# Altium project Control_Board_Model_C201.PrjPcb (part 5 of 8)

## Sheet User_Interface.SchDoc: User Interface
size A4; DocumentNumber: 13; SheetNumber: 13; SheetTotal: 50
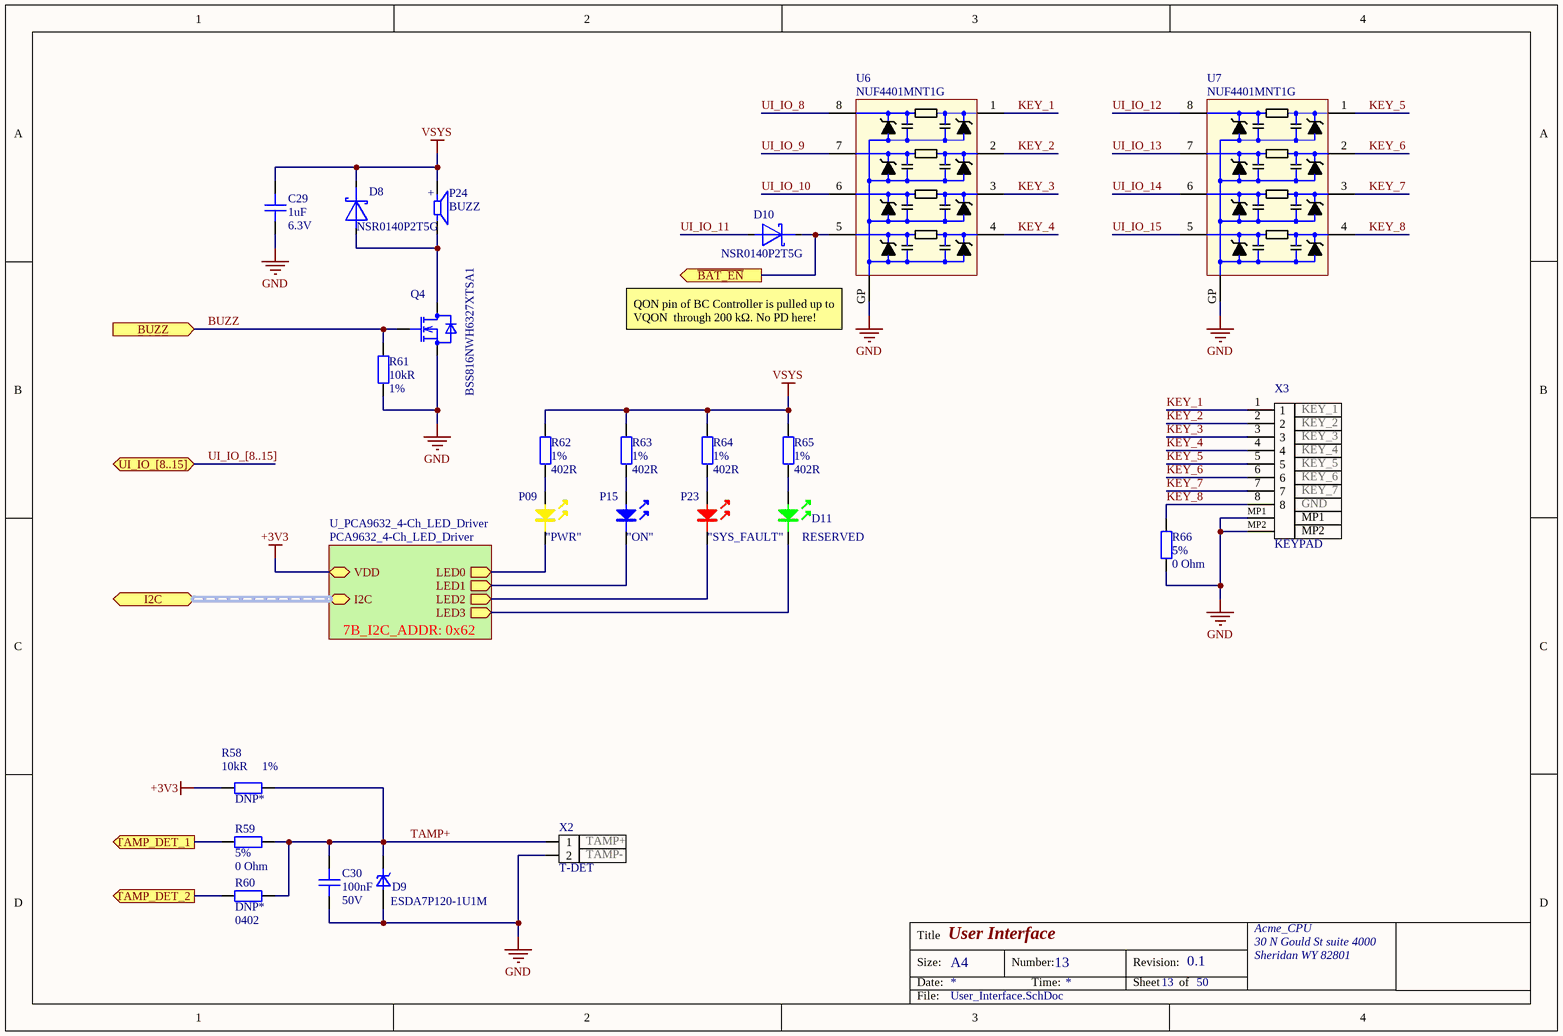
[diagram p10: User_Interface.SchDoc]

### Parts
C29  Capacitance: 1uF  Voltage Rating: 6.3V  [C0402]  (hidden comment: CAP CER 1UF 6.3V X5R 0402)
C30  Capacitance: 100nF  Voltage: 50V  [C0402]  (hidden comment: CAP CER 0.1UF 50V X7R 0402)
D8  NSR0140P2T5G  [SODFL100X40-2N]
D9  ESDA7P120-1U1M  [ST_QFN_1610]
D10  NSR0140P2T5G  [SODFL100X40-2N]
D11  RESERVED  [LED_0603]
P09  "PWR"  [LED_0603]
P15  "ON"  [LED_0603]
P23  "SYS_FAULT"  [LED_0603]
P24  BUZZ  [SMT-0440-S-R_PUI]
Q4  BSS816NWH6327XTSA1  [SOT-323]
R58  DNP*  Resistance: 10kR  Tolerance: 1%  [R0402]  (no BOM)
R59  Tolerance: 5%  Resistance: 0 Ohm  [R0402]  (hidden comment: RES SMD 0 OHM JUMPER 1/16W 0402)
R60  DNP*  Case/Package: 0402  [R0402]  (no BOM)
R61  Resistance: 10kR  Tolerance: 1%  [R0402]  (hidden comment: RES SMD 10K OHM 1% 1/16W 0402)
R62  Tolerance: 1%  Resistance: 402R  [R0402]  (hidden comment: RES SMD 402 OHM 1% 1/16W 0402)
R63  Tolerance: 1%  Resistance: 402R  [R0402]  (hidden comment: RES SMD 402 OHM 1% 1/16W 0402)
R64  Tolerance: 1%  Resistance: 402R  [R0402]  (hidden comment: RES SMD 402 OHM 1% 1/16W 0402)
R65  Tolerance: 1%  Resistance: 402R  [R0402]  (hidden comment: RES SMD 402 OHM 1% 1/16W 0402)
R66  Tolerance: 5%  Resistance: 0 Ohm  [R0402]  (hidden comment: RES SMD 0 OHM JUMPER 1/16W 0402)
U6  NUF4401MNT1G  [DFN8]
U7  NUF4401MNT1G  [DFN8]
X2  T-DET  pin_1: TAMP+  pin_2: TAMP-  [CONN_S2B-ZR_JST]
X3  KEYPAD  pin_7: KEY_7  pin_1: KEY_1  pin_2: KEY_2  pin_3: KEY_3  pin_4: KEY_4  pin_5: KEY_5  pin_6: KEY_6  pin_8: GND  pin_MP1: MP1  pin_MP2: MP2  [686108183522]

### Sub-sheets
U_PCA9632_4-Ch_LED_Driver = PCA9632_4-Ch_LED_Driver (file not in this document): VDD, LED0 (out), LED1 (out), LED2 (out), LED3 (out), I2C (harness I2C)  | 7B_I2C_ADDR: 0x62

### Ports
BUZZ (in), I2C (harness I2C), TAMP_DET_1 (out), TAMP_DET_2 (out), UI_IO_[8..15] (bidir), ~{BAT_EN} (out)

### Nets
+3V3: R58.1 ; sheet U_PCA9632_4-Ch_LED_Driver/VDD
GND: C29.2 C30.2 D9.2(A) Q4.2(S) R61.2 R66.1 U6.GP(GND) U7.GP(GND) X2.2 X3.MP1 X3.MP2
VSYS: C29.1 D8.1(K) P24.1 R62.2 R63.2 R64.2 R65.2
~{UI_BAT_EN}: D10.1(K) U6.5(OUT4) ; port ~{BAT_EN}
BUZZ: Q4.1(G) R61.1 ; port BUZZ
KEY_1: U6.1(INP1) X3.1
KEY_2: U6.2(INP2) X3.2
KEY_3: U6.3(INP3) X3.3
KEY_4: U6.4(INP4) X3.4
KEY_5: U7.1(INP1) X3.5
KEY_6: U7.2(INP2) X3.6
KEY_7: U7.3(INP3) X3.7
KEY_8: R66.2 U7.4(INP4) X3.8
PC13: R59.1 ; port TAMP_DET_1
TAMP+: C30.1 D9.1(K) R58.2 R59.2 R60.1 X2.1
TAMP_RTC: R60.2 ; port TAMP_DET_2
UI_IO_8: U6.8(OUT1)  [project net DIO_3_8]
UI_IO_9: U6.7(OUT2)  [project net DIO_3_9]
UI_IO_10: U6.6(OUT3)  [project net DIO_3_10]
UI_IO_11: D10.2(A)  [project net DIO_3_11]
UI_IO_12: U7.8(OUT1)  [project net DIO_3_12]
UI_IO_13: U7.7(OUT2)  [project net DIO_3_13]
UI_IO_14: U7.6(OUT3)  [project net DIO_3_14]
UI_IO_15: U7.5(OUT4)  [project net DIO_3_15]
NetD8_2: D8.2(A) P24.2 Q4.3(D)
NetD11_1: D11.1(K) ; sheet U_PCA9632_4-Ch_LED_Driver/LED3
NetD11_2: D11.2(A) R65.1
NetP09_1: P09.1(K) ; sheet U_PCA9632_4-Ch_LED_Driver/LED0
NetP09_2: P09.2(A) R62.1
NetP15_1: P15.1(K) ; sheet U_PCA9632_4-Ch_LED_Driver/LED1
NetP15_2: P15.2(A) R63.1
NetP23_1: P23.1(K) ; sheet U_PCA9632_4-Ch_LED_Driver/LED2
NetP23_2: P23.2(A) R64.1

### Buses and harness runs
bus UI_IO_[8..15] = port UI_IO_[8..15]
harness port I2C = sheet U_PCA9632_4-Ch_LED_Driver/I2C

### Notes on the sheet
- (near U6) QON pin of BC Controller is pulled up to VQON  through 200 kΩ. No PD here!
- Title
- Size:
- Date:
- A4
- Number:
- Time:
- Revision:
- Sheet
- of
- File:
- (in symbol AUDIO MAGNETIC XDCR 2-4V SMD) +

### Library data of the parts
C29 = CAP CER 1UF 6.3V X5R 0402: 1µF ±10% 6.3V Ceramic Capacitor X5R 0402 (1005 Metric); Manufacturer: Yageo; Manufacturer Part Number: CC0402KRX5R5BB105; Supplier 1: Digi-Key; Stock 1: 34926286; Pricing 1: 1=0.1, 10=0.05, 50=0.0272, 100=0.0222, 500=0.0158, 1000=0.0124, 2500=0.0113, 5000=0.0104 (USD); Mount: Surface Mount; Case/Package: 0402; Number of Pins: 2; Case Code (Metric): 1005; Case Code (Imperial): 0402; Min Operating Temperature: -55°C; Max Operating Temperature: 85°C; Packaging: Tape and Reel; Tolerance: 10%; Voltage Rating (DC): 6.3V; Dielectric: X5R; Termination: SMD/SMT; Package Quantity: 1; Composition: Ceramic; Length: 1mm; Height: 0.5mm; Width: 0.02inch; Thickness: 0.022inch; Depth: 0.5mm; Radiation Hardening: No; REACH SVHC: No SVHC; ComponentLink1URL: http://www.farnell.com/datasheets/70765.pdf?src-supplier=Farnell; ComponentLink1Description: http://www.farnell.com/datasheets/70765.pdf?src-supplier=Farnell; ComponentLink2URL: http://www.yageo.com/documents/recent/UPY-GPHC_X5R_4V-to-50V_25.pdf?src-supplier=Digi-Key; ComponentLink2Description: http://www.yageo.com/documents/recent/UPY-GPHC_X5R_4V-to-50V_25.pdf?src-supplier=Digi-Key; ComponentLink3URL: http://www.farnell.com/datasheets/2167237.pdf?src-supplier=Element14; ComponentLink3Description: http://www.farnell.com/datasheets/2167237.pdf?src-supplier=Element14; ComponentLink4URL: http://www.yageo.com/documents/recent/UPY-GPHC_X5R_4V-to-50V_12.pdf?src-supplier=Avnet+Europe; ComponentLink4Description: http://www.yageo.com/documents/recent/UPY-GPHC_X5R_4V-to-50V_12.pdf?src-supplier=Avnet+Europe; ComponentLink5URL: http://www.farnell.com/datasheets/1359354.pdf?src-supplier=Element14; ComponentLink5Description: http://www.farnell.com/datasheets/1359354.pdf?src-supplier=Element14; Supplier Part Number 1: 311-1438-1-ND; Dielectric Material: Ceramic; Lead Free: Lead Free; Halogen Free: Halogen Free; ComponentLink6URL: http://www.farnell.com/datasheets/70765.pdf?src-supplier=Element14; ComponentLink6Description: http://www.farnell.com/datasheets/70765.pdf?src-supplier=Element14; ComponentLink7URL: http://www.yageo.com/documents/recent/UPY-GPHC_X5R_4V-to-50V_12.pdf?src-supplier=Avnet; ComponentLink7Description: http://www.yageo.com/documents/recent/UPY-GPHC_X5R_4V-to-50V_12.pdf?src-supplier=Avnet
C30 = CAP CER 0.1UF 50V X7R 0402: 0.1µF ±10% 50V Ceramic Capacitor X7R 0402 (1005 Metric); Manufacturer: TDK; Manufacturer Part Number: CGA2B3X7R1H104K050BB; Supplier 1: Digi-Key; Supplier Part Number 1: 445-6899-1-ND; Stock 1: 2925303; Pricing 1: 1=0.17, 10=0.118, 50=0.0668, 100=0.0553, 500=0.0388, 1000=0.0321, 2500=0.0299, 5000=0.0273 (USD); Mount: Surface Mount; Case/Package: 0402; Weight: 2.3E-05oz; Case Code (Metric): 1005; Case Code (Imperial): 0402; Min Operating Temperature: -55°C; Max Operating Temperature: 125°C; Voltage Rating: 50V; Tolerance: 10%; Packaging: Tape and Reel; Package Quantity: 1; Voltage Rating (DC): 50V; Dielectric: X7R; Termination: SMD/SMT; Composition: Ceramic; Length: 1mm; Height: 0.5mm; Width: 0.02inch; Thickness: 0.022inch; Depth: 0.5mm; Ratings: AEC-Q200; REACH SVHC: No SVHC; Lead Free: Lead Free; ComponentLink1URL: http://product.tdk.com/capacitor/mlcc/en/documents/mlccspec_automotive_general_midvoltage_en.pdf?src-supplier=Future+Electronics; ComponentLink1Description: http://product.tdk.com/capacitor/mlcc/en/documents/mlccspec_automotive_general_midvoltage_en.pdf?src-supplier=Future+Electronics; ComponentLink2URL: http://www.farnell.com/datasheets/1807242.pdf?src-supplier=Element14; ComponentLink2Description: http://www.farnell.com/datasheets/1807242.pdf?src-supplier=Element14; ComponentLink3URL: http://www.mouser.com/ds/2/400/lcc_automotive_general_en-843974.pdf?src-supplier=Mouser; ComponentLink3Description: http://www.mouser.com/ds/2/400/lcc_automotive_general_en-843974.pdf?src-supplier=Mouser; ComponentLink4URL: http://www.farnell.com/datasheets/1936565.pdf?src-supplier=Element14; ComponentLink4Description: http://www.farnell.com/datasheets/1936565.pdf?src-supplier=Element14; ComponentLink5URL: http://www.farnell.com/datasheets/1735392.pdf?src-supplier=Element14; ComponentLink5Description: http://www.farnell.com/datasheets/1735392.pdf?src-supplier=Element14
D8 = DIODE SCHOTTKY 30V 70MA SOD923: Diode Schottky 30V 70mA (DC) Surface Mount SOD-923; Manufacturer: ON Semiconductor; Forward Voltage: 350mV; Max Surge Current: 500mA; Peak Reverse Current: 500nA; Element Configuration: Single; Max Power Dissipation: 100mW; Supplier 1: Digi-Key; Manufacturer Part Number: NSR0140P2T5G; Stock 1: 28802; Pricing 1: 1=0.36, 10=0.27, 25=0.2368, 100=0.1284, 500=0.1048, 1000=0.0777, 2500=0.0683 (USD); Min Operating Temperature: -55°C; Max Operating Temperature: 125°C; Packaging: Tape and Reel; Radiation Hardening: No; Lead Free: Lead Free; ComponentLink1URL: http://www.onsemi.com/pub_link/Collateral/NSR0140P2-D.PDF?src-supplier=Future+Electronics; ComponentLink1Description: http://www.onsemi.com/pub_link/Collateral/NSR0140P2-D.PDF?src-supplier=Future+Electronics; ComponentLink2URL: http://www.farnell.com/datasheets/2353885.pdf?src-supplier=Newark; ComponentLink2Description: http://www.farnell.com/datasheets/2353885.pdf?src-supplier=Newark; ComponentLink3URL: http://www.farnell.com/datasheets/86281.pdf?src-supplier=Element14; ComponentLink3Description: http://www.farnell.com/datasheets/86281.pdf?src-supplier=Element14; Supplier Part Number 1: NSR0140P2T5GOSCT-ND; Number of Pins: 2; Forward Current: 70mA; Package Quantity: 1; Average Rectified Current: 70mA; Max Repetitive Reverse Voltage (Vrrm): 30V; Peak Non-Repetitive Surge Current: 500mA; Max Reverse Voltage (DC): 30V; Max Reverse Leakage Current: 500nA; Case/Package: SOD-923-2; Contact Plating: Tin,Matte; Power Dissipation: 100mW; Max Forward Surge Current (Ifsm): 500mA; Termination: SMD/SMT; Length: 0.85mm; Height: 0.43mm; Width: 0.65mm; REACH SVHC: No SVHC; ComponentLink4URL: http://www.onsemi.com/pub/Collateral/NSR0140P2-D.PDF?src-supplier=Avnet; ComponentLink4Description: http://www.onsemi.com/pub/Collateral/NSR0140P2-D.PDF?src-supplier=Avnet; ComponentLink5URL: http://www.onsemi.com/pub/Collateral/NSR0140P2-D.PDF?src-supplier=Digi-Key; ComponentLink5Description: http://www.onsemi.com/pub/Collateral/NSR0140P2-D.PDF?src-supplier=Digi-Key; ComponentLink6URL: http://www.mouser.com/ds/2/308/NSR0140P2-D-115172.pdf?src-supplier=Mouser; ComponentLink6Description: http://www.mouser.com/ds/2/308/NSR0140P2-D-115172.pdf?src-supplier=Mouser; Mount: Surface Mount
D9 = TVS DIODE ESDA7P120-1U1M 5.5V 11.5V 1610: 11.5V Clamp 120A (8/20µs) Ipp Tvs Diode Surface Mount 1610; Manufacturer: STMicroelectronics; Number of Unidirectional Channels: 1; Reverse Standoff Voltage: 5.5V; Min Breakdown Voltage: 6.4V; Peak Pulse Power: 1.4kW; Power Line Protection: No; Supplier 1: Digi-Key; Manufacturer Part Number: ESDA7P120-1U1M; Stock 1: 15775; Pricing 1: 1=0.35, 10=0.287, 25=0.2624, 100=0.1647, 250=0.1629, 500=0.1525, 1000=0.1037, 2500=0.0994 (USD); ComponentLink1URL: http://www.st.com/content/ccc/resource/technical/document/datasheet/group3/5e/7c/5d/76/3f/de/45/35/DM00359316/files/DM00359316.pdf/jcr:content/translations/en.DM00359316.pdf?src-supplier=Digi-Key; ComponentLink1Description: http://www.st.com/content/ccc/resource/technical/document/datasheet/group3/5e/7c/5d/76/3f/de/45/35/DM00359316/files/DM00359316.pdf/jcr:content/translations/en.DM00359316.pdf?src-supplier=Digi-Key; Supplier Part Number 1: 497-17159-1-ND; Packaging: Cut Tape; Clamping Voltage: 11.5V; ComponentLink2URL: http://www.farnell.com/datasheets/2815837.pdf?src-supplier=Newark; ComponentLink2Description: http://www.farnell.com/datasheets/2815837.pdf?src-supplier=Newark; Mount: Surface Mount; Case/Package: 0603; Case Code (Imperial): 0603; Case Code (Metric): 1610; Min Operating Temperature: -55°C; Max Operating Temperature: 150°C; Composition: Zener; Peak Pulse Current: 120A; ComponentLink3URL: http://www.farnell.com/datasheets/2815837.pdf?src-supplier=Farnell; ComponentLink3Description: http://www.farnell.com/datasheets/2815837.pdf?src-supplier=Farnell; ComponentLink4URL: http://www.farnell.com/datasheets/2815837.pdf?src-supplier=Element14; ComponentLink4Description: http://www.farnell.com/datasheets/2815837.pdf?src-supplier=Element14
D10 = DIODE SCHOTTKY 30V 70MA SOD923: Diode Schottky 30V 70mA (DC) Surface Mount SOD-923; Manufacturer: ON Semiconductor; Forward Voltage: 350mV; Max Surge Current: 500mA; Max Power Dissipation: 100mW; Max Reverse Leakage Current: 500nA; Element Configuration: Single; Supplier 1: Digi-Key; Manufacturer Part Number: NSR0140P2T5G; Stock 1: 28802; Pricing 1: 1=0.36, 10=0.27, 25=0.2368, 100=0.1284, 500=0.1048, 1000=0.0777, 2500=0.0683 (USD); Case/Package: SOD-923-2; Number of Pins: 2; Contact Plating: Tin,Matte; Min Operating Temperature: -55°C; Max Operating Temperature: 125°C; Forward Current: 70mA; Package Quantity: 1; Packaging: Tape and Reel; Average Rectified Current: 70mA; Max Repetitive Reverse Voltage (Vrrm): 30V; Peak Reverse Current: 500nA; Power Dissipation: 100mW; Peak Non-Repetitive Surge Current: 500mA; Max Forward Surge Current (Ifsm): 500mA; Termination: SMD/SMT; Max Reverse Voltage (DC): 30V; Length: 0.85mm; Height: 0.43mm; Width: 0.65mm; Radiation Hardening: No; REACH SVHC: No SVHC; Lead Free: Lead Free; ComponentLink1URL: http://www.onsemi.com/pub_link/Collateral/NSR0140P2-D.PDF?src-supplier=Future+Electronics; ComponentLink1Description: http://www.onsemi.com/pub_link/Collateral/NSR0140P2-D.PDF?src-supplier=Future+Electronics; ComponentLink2URL: http://www.farnell.com/datasheets/2353885.pdf?src-supplier=Newark; ComponentLink2Description: http://www.farnell.com/datasheets/2353885.pdf?src-supplier=Newark; ComponentLink3URL: http://www.farnell.com/datasheets/86281.pdf?src-supplier=Element14; ComponentLink3Description: http://www.farnell.com/datasheets/86281.pdf?src-supplier=Element14; ComponentLink4URL: http://www.onsemi.com/pub/Collateral/NSR0140P2-D.PDF?src-supplier=Avnet; ComponentLink4Description: http://www.onsemi.com/pub/Collateral/NSR0140P2-D.PDF?src-supplier=Avnet; ComponentLink5URL: http://www.onsemi.com/pub/Collateral/NSR0140P2-D.PDF?src-supplier=Digi-Key; ComponentLink5Description: http://www.onsemi.com/pub/Collateral/NSR0140P2-D.PDF?src-supplier=Digi-Key; ComponentLink6URL: http://www.mouser.com/ds/2/308/NSR0140P2-D-115172.pdf?src-supplier=Mouser; ComponentLink6Description: http://www.mouser.com/ds/2/308/NSR0140P2-D-115172.pdf?src-supplier=Mouser; Supplier Part Number 1: NSR0140P2T5GOSCT-ND; Mount: Surface Mount
D11 = LED GREEN CLEAR 0603 SMD: Green 571nm LED Indication - Discrete 2V 0603 (1608 Metric); Manufacturer: Vishay Lite-On; Manufacturer Part Number: LTST-C191KGKT; Lens Style: Rectangular,Colorless; Lens Transparency: Clear; Luminous Intensity: 35mcd; Test Current: 20mA; Viewing Angle: 130°; Lens Color: Colorless; Forward Current: 30mA; Number of Elements: 1; Power Dissipation: 75mW; Wavelength: 574nm; Reverse Voltage: 5V; Supplier 1: Digi-Key; Stock 1: 788359; Pricing 1: 1=0.28, 10=0.201, 100=0.0954, 500=0.0636, 1000=0.0498, 2500=0.0488 (USD); Mount: Surface Mount; Case Code (Imperial): 0603; Case Code (Metric): 1608; Packaging: Tape and Reel; Forward Voltage: 2V; Dominant Wavelength: 571nm; Length: 1.6mm; Height: 0.55mm; Width: 0.8mm; ComponentLink1URL: http://optoelectronics.liteon.com/upload/download/DS22-2000-228/LTST-C191KGKT.PDF?src-supplier=Digi-Key; ComponentLink1Description: http://optoelectronics.liteon.com/upload/download/DS22-2000-228/LTST-C191KGKT.PDF?src-supplier=Digi-Key; Supplier Part Number 1: 160-1446-6-ND; Number of Pins: 2; Min Operating Temperature: -55°C; Max Operating Temperature: 85°C; Package Quantity: 1; Illumination Color: Green; Number of LEDs: 1; Depth: 0.8mm; Radiation Hardening: No; Lead Free: Lead Free; Power Rating: 75mW; Max Power Dissipation: 75mW
P09 = LED YELLOW CLEAR 0603 SMD: Yellow 591nm LED Indication - Discrete 2.1V 0603 (1608 Metric); Manufacturer: Vishay Lite-On; Manufacturer Part Number: LTST-C191KSKT; Lens Style: Diffused,Colorless,Rectangular,Clear; Lens Transparency: Clear; Luminous Intensity: 180mcd; Forward Voltage: 2.4V; Test Current: 20mA; Viewing Angle: 130°; Dominant Wavelength: 597nm; Lens Color: Colorless; Forward Current: 30mA; Power Rating: 75mW; Number of Elements: 1; Wavelength: 588nm; Reverse Voltage: 5V; Supplier 1: Digi-Key; Stock 1: 614196; Pricing 1: 1=0.28, 10=0.204, 100=0.0968, 500=0.0645, 1000=0.0505, 2500=0.0495 (USD); Mount: Surface Mount; Case/Package: 0603; Color: Yellow; Case Code (Imperial): 0603; Case Code (Metric): 1608; Packaging: Tape and Reel; Length: 1.6mm; Height: 0.55mm; Width: 0.8mm; ComponentLink1URL: http://optoelectronics.liteon.com/upload/download/DS22-2000-224/LTST-C191KSKT.PDF?src-supplier=Digi-Key; ComponentLink1Description: http://optoelectronics.liteon.com/upload/download/DS22-2000-224/LTST-C191KSKT.PDF?src-supplier=Digi-Key; ComponentLink2URL: https://www.verical.com/server-webapp/html/getDatasheet?partID=141495&src-supplier=Verical; ComponentLink2Description: https://www.verical.com/server-webapp/html/getDatasheet?partID=141495&src-supplier=Verical; ComponentLink3URL: http://www.mouser.com/ds/2/239/LTST-C191KSKT-1141271.pdf?src-supplier=Mouser; ComponentLink3Description: http://www.mouser.com/ds/2/239/LTST-C191KSKT-1141271.pdf?src-supplier=Mouser; ComponentLink4URL: http://www1.futureelectronics.com/doc/LITE%20ON/LITE-ON%20LTST-C191KSKT.pdf?src-supplier=Future+Electronics; ComponentLink4Description: http://www1.futureelectronics.com/doc/LITE%20ON/LITE-ON%20LTST-C191KSKT.pdf?src-supplier=Future+Electronics; Supplier Part Number 1: 160-1448-1-ND; Number of Pins: 2; Min Operating Temperature: -55°C; Max Operating Temperature: 85°C; Package Quantity: 1; Illumination Color: Yellow; Power Dissipation: 75mW; Number of LEDs: 1; Depth: 0.8mm; Radiation Hardening: No; Lead Free: Lead Free
P15 = LED BLUE CLEAR 0603 SMD: Blue 470nm LED Indication - Discrete 3.3V 0603 (1608 Metric); Manufacturer: Vishay Lite-On; Manufacturer Part Number: LTST-C191TBKT; Lens Style: Diffused,Colorless,Clear,Rectangular; Lens Transparency: Clear; Luminous Intensity: 180mcd; Forward Voltage: 3.8V; Test Current: 20mA; Viewing Angle: 130°; Dominant Wavelength: 475nm; Lens Color: Colorless; Number of Elements: 1; Power Dissipation: 76mW; Wavelength: 468nm; Reverse Voltage: 5V; Max Power Dissipation: 75mW; Supplier 1: Digi-Key; Stock 1: 239244; Pricing 1: 1=0.48, 10=0.342, 100=0.152, 500=0.1064, 1000=0.0874, 2500=0.076 (USD); Mount: Surface Mount; Case Code (Imperial): 0603; Case Code (Metric): 1608; Packaging: Tape and Reel; Length: 0.8mm; Height: 0.55mm; Width: 0.8mm; ComponentLink1URL: http://optoelectronics.liteon.com/upload/download/DS22-2000-230/LTST-C191TBKT.pdf?src-supplier=Digi-Key; ComponentLink1Description: http://optoelectronics.liteon.com/upload/download/DS22-2000-230/LTST-C191TBKT.pdf?src-supplier=Digi-Key; Supplier Part Number 1: 160-1647-1-ND; Number of Pins: 2; Min Operating Temperature: -20°C; Max Operating Temperature: 80°C; Forward Current: 20mA; Package Quantity: 1; Illumination Color: Blue; Number of LEDs: 1; Depth: 1.6mm; Radiation Hardening: No; Lead Free: Lead Free; Case/Package: 0603; Color: Blue; ComponentLink2URL: http://optoelectronics.liteon.com/upload/download/DS22-2000-230/LTST-C191TBKT.pdf?src-supplier=Verical; ComponentLink2Description: http://optoelectronics.liteon.com/upload/download/DS22-2000-230/LTST-C191TBKT.pdf?src-supplier=Verical; ComponentLink3URL: http://optoelectronics.liteon.com/upload/download/DS22-2000-230/LTST-C191TBKT.pdf?src-supplier=Mouser; ComponentLink3Description: http://optoelectronics.liteon.com/upload/download/DS22-2000-230/LTST-C191TBKT.pdf?src-supplier=Mouser; ComponentLink4URL: http://www1.futureelectronics.com/doc/LITE-ON/LTST-C191TBKT.pdf?src-supplier=Future+Electronics; ComponentLink4Description: http://www1.futureelectronics.com/doc/LITE-ON/LTST-C191TBKT.pdf?src-supplier=Future+Electronics; ComponentLink5URL: http://optoelectronics.liteon.com/upload/download/DS22-2000-230/LTST-C191TBKT.pdf?src-supplier=Jameco; ComponentLink5Description: http://optoelectronics.liteon.com/upload/download/DS22-2000-230/LTST-C191TBKT.pdf?src-supplier=Jameco; ComponentLink6URL: http://uk.rs-online.com/webdocs/0dc0/0900766b80dc02b4.pdf?src-supplier=RSComponents; ComponentLink6Description: http://uk.rs-online.com/webdocs/0dc0/0900766b80dc02b4.pdf?src-supplier=RSComponents; ComponentLink7URL: http://datasheet.iiic.cc/lite-on/LTST-C191TBKT.pdf?src-supplier=IIIC; ComponentLink7Description: http://datasheet.iiic.cc/lite-on/LTST-C191TBKT.pdf?src-supplier=IIIC
P23 = LED RED CLEAR 0603 SMD: Red 631nm LED Indication - Discrete 2V 0603 (1608 Metric); Manufacturer: Vishay Lite-On; Manufacturer Part Number: LTST-C191KRKT; Lens Style: Clear,Diffused,Colorless,Rectangular; Lens Transparency: Clear; Luminous Intensity: 54mcd; Test Current: 20mA; Viewing Angle: 130°; Lens Color: Colorless; Forward Current: 30mA; Number of Elements: 1; Power Dissipation: 75mW; Wavelength: 639nm; Reverse Voltage: 5V; Supplier 1: Digi-Key; Stock 1: 230321; Pricing 1: 1=0.26, 10=0.192, 100=0.0909, 500=0.0606, 1000=0.0475, 2500=0.0465 (USD); Mount: Surface Mount; Case/Package: 0603; Color: Red; Case Code (Imperial): 0603; Case Code (Metric): 1608; Packaging: Tape and Reel; Forward Voltage: 2V; Dominant Wavelength: 631nm; Length: 1.6mm; Height: 0.55mm; Width: 0.8mm; ComponentLink1URL: http://optoelectronics.liteon.com/upload/download/DS22-2000-223/LTST-C191KRKT.PDF?src-supplier=Digi-Key; ComponentLink1Description: http://optoelectronics.liteon.com/upload/download/DS22-2000-223/LTST-C191KRKT.PDF?src-supplier=Digi-Key; ComponentLink2URL: http://www1.futureelectronics.com/doc/LITE-ON/LTST-C191KRKT.pdf?src-supplier=Future+Electronics; ComponentLink2Description: http://www1.futureelectronics.com/doc/LITE-ON/LTST-C191KRKT.pdf?src-supplier=Future+Electronics; ComponentLink3URL: https://www.verical.com/server-webapp/html/getDatasheet?partID=141922&src-supplier=Verical; ComponentLink3Description: https://www.verical.com/server-webapp/html/getDatasheet?partID=141922&src-supplier=Verical; ComponentLink4URL: http://www.mouser.com/ds/2/239/LTST-C191KRKT-1140668.pdf?src-supplier=Mouser; ComponentLink4Description: http://www.mouser.com/ds/2/239/LTST-C191KRKT-1140668.pdf?src-supplier=Mouser; Supplier Part Number 1: 160-1447-1-ND; Number of Pins: 2; Min Operating Temperature: -55°C; Max Operating Temperature: 85°C; Package Quantity: 1; Illumination Color: Red; Number of LEDs: 1; Depth: 0.8mm; Radiation Hardening: No; Lead Free: Lead Free; Power Rating: 75mW; Voltage: 2V
P24 = AUDIO MAGNETIC XDCR 2-4V SMD: Buzzers Transducer, Externally Driven 90mA 4kHz 70dB @ 3V, 10cm Surface Mount Solder Pads; Manufacturer: Projects Unlimited; Manufacturer Part Number: SMT-0440-S-R; Supplier 1: Digi-Key; Stock 1: 4568; Pricing 1: 1=3.25, 10=2.689, 25=2.4812, 50=2.3302, 100=2.185, 500=1.885 (USD); Mount: Surface Mount; Min Operating Temperature: -20°C; Max Operating Temperature: 70°C; Termination: Solder; Frequency: 4kHz; Packaging: Tape and Reel; Voltage Rating: 3V; ComponentLink1URL: http://www.puiaudio.com/pdf/SMT-0440-S-R.pdf?src-supplier=Avnet; ComponentLink1Description: http://www.puiaudio.com/pdf/SMT-0440-S-R.pdf?src-supplier=Avnet; ComponentLink2URL: http://www.mouser.com/ds/2/334/SMT-0440-S-R-535654.pdf?src-supplier=Mouser; ComponentLink2Description: http://www.mouser.com/ds/2/334/SMT-0440-S-R-535654.pdf?src-supplier=Mouser; ComponentLink3URL: http://www.puiaudio.com/pdf/SMT-0440-S-R.pdf?src-supplier=Digi-Key; ComponentLink3Description: http://www.puiaudio.com/pdf/SMT-0440-S-R.pdf?src-supplier=Digi-Key; Supplier Part Number 1: 668-1488-1-ND; Operating Supply Current: 90mA; Sensing Method: Magnetic; Length: 4mm; Width: 4mm
Q4 = MOSFET BSS816NWH6327XTSA1 N-CH 20V 1.4A SOT323: N-Channel 20V 1.4A (Ta) 500mW (Ta) Surface Mount PG-SOT323-3; Manufacturer: Infineon; Rds On Max: 160mR; Rise Time: 9ns; Input Capacitance: 180pF; Turn-On Delay Time: 5.3ns; Turn-Off Delay Time: 11ns; Fall Time: 2.2ns; Threshold Voltage: 550mV; Gate to Source Voltage (Vgs): 8V; Number of Channels: 1; Supplier 1: Digi-Key; Manufacturer Part Number: BSS816NWH6327XTSA1; Stock 1: 12407; Pricing 1: 1=0.37, 10=0.306, 25=0.2564, 100=0.1254, 250=0.1234, 500=0.1046, 1000=0.0727 (USD); Mount: Surface Mount; Case/Package: SOT-323; Number of Pins: 3; Weight: 0.004395oz; Contact Plating: Tin; Min Operating Temperature: -55°C; Max Operating Temperature: 150°C; Packaging: Tape and Reel; Drain to Source Voltage (Vdss): 20V; Max Dual Supply Voltage: 20V; Continuous Drain Current (ID): 1.4A; Max Power Dissipation: 500mW; Drain to Source Breakdown Voltage: 20V; Drain to Source Resistance: 160mR; Package Quantity: 3000; Halogen Free: Halogen Free; REACH SVHC: No SVHC; Lead Free: Lead Free; ComponentLink1URL: http://www.infineon.com/dgdl/BSS816NW_Rev2.3_.pdf?folderId=db3a3043156fd573011622e10b5c1f67&fileId=db3a304335113a6301351e704a2e1332&src-supplier=Avnet; ComponentLink1Description: http://www.infineon.com/dgdl/BSS816NW_Rev2.3_.pdf?folderId=db3a3043156fd573011622e10b5c1f67&fileId=db3a304335113a6301351e704a2e1332&src-supplier=Avnet; ComponentLink2URL: http://www.farnell.com/datasheets/2117725.pdf?src-supplier=Farnell; ComponentLink2Description: http://www.farnell.com/datasheets/2117725.pdf?src-supplier=Farnell; ComponentLink3URL: https://www.infineon.com/dgdl/Infineon-BSS816NW-DS-v02_03-en.pdf?fileId=db3a304335113a6301351e704a2e1332&src-supplier=Digi-Key; ComponentLink3Description: https://www.infineon.com/dgdl/Infineon-BSS816NW-DS-v02_03-en.pdf?fileId=db3a304335113a6301351e704a2e1332&src-supplier=Digi-Key; ComponentLink4URL: http://components.arrow.com/part/dataview/53682469S9650N2051?src-supplier=Arrow; ComponentLink4Description: http://components.arrow.com/part/dataview/53682469S9650N2051?src-supplier=Arrow; ComponentLink5URL: http://www.farnell.com/datasheets/2117725.pdf?src-supplier=Element14; ComponentLink5Description: http://www.farnell.com/datasheets/2117725.pdf?src-supplier=Element14; ComponentLink6URL: http://www.mouser.com/ds/2/196/Infineon-BSS816NW-DS-v02_03-en-522793.pdf?src-supplier=Mouser; ComponentLink6Description: http://www.mouser.com/ds/2/196/Infineon-BSS816NW-DS-v02_03-en-522793.pdf?src-supplier=Mouser; Supplier Part Number 1: BSS816NWH6327XTSA1CT-ND
R58 = RES SMD 10K OHM 1% 1/16W 0402: 10 kOhms ±1% 0.063W, 1/16W Chip Resistor 0402 (1005 Metric) Moisture Resistant Thick Film; Manufacturer: Yageo; Manufacturer Part Number: RC0402FR-0710KP; Temperature Coefficient: 150ppm/°C; Max Power Dissipation: 63mW; Supplier 1: Digi-Key; Stock 1: 839368; Pricing 1: 1=0.1, 10=0.035, 100=0.014, 1000=0.0063, 2500=0.0055, 5000=0.0045 (USD); Case/Package: 0402; Case Code (Metric): 1005; Case Code (Imperial): 0402; Min Operating Temperature: -55°C; Max Operating Temperature: 155°C; Packaging: Tape and Reel; Length: 0.039inch; Height: 0.016inch; Width: 0.02inch; ComponentLink1URL: http://www.yageo.com/NewPortal/yageodocoutput?fileName=/pdf/R-Chip/PYu-RC_51_RoHS_P_0.pdf&src-supplier=Digi-Key; ComponentLink1Description: http://www.yageo.com/NewPortal/yageodocoutput?fileName=/pdf/R-Chip/PYu-RC_51_RoHS_P_0.pdf&src-supplier=Digi-Key; Supplier Part Number 1: YAG1249CT-ND; Composition: Thick Film; Number of Terminations: 2; Features: Moisture Resistant
R59 R66 = RES SMD 0 OHM JUMPER 1/16W 0402: 0 Ohms Jumper 0.063W, 1/16W Chip Resistor 0402 (1005 Metric) Moisture Resistant Thick Film; Manufacturer: Yageo; Manufacturer Part Number: RC0402JR-070RL; Power Rating: 62.5mW; Voltage Rating: 50V; Max Power Dissipation: 63mW; Temperature Coefficient: 200ppm/°C; Supplier 1: Digi-Key; Stock 1: 46057148; Pricing 1: 1=0.1, 10=0.013, 25=0.0092, 50=0.0072, 100=0.0053, 250=0.004, 500=0.0032, 1000=0.0024, 5000=0.0017 (USD); Contact Plating: Tin,Matte; Case Code (Metric): 1005; Case Code (Imperial): 0402; Min Operating Temperature: -55°C; Max Operating Temperature: 155°C; Packaging: Tape and Reel; Composition: Thick Film; Package Quantity: 1; Number of Terminations: 2; Termination: SMD/SMT; Military Standard: Not; Features: Moisture Resistant; Length: 1mm; Height: 0.016inch; Width: 0.02inch; Depth: 0.5mm; Radiation Hardening: No; REACH SVHC: Unknown; Lead Free: Lead Free; ComponentLink1URL: http://www.yageo.com/documents/recent/PYu-RC_Group_51_RoHS_L_10.pdf?src-supplier=Digi-Key; ComponentLink1Description: http://www.yageo.com/documents/recent/PYu-RC_Group_51_RoHS_L_10.pdf?src-supplier=Digi-Key; ComponentLink2URL: http://www.yageo.com/documents/recent/PYu-RC0402_51_RoHS_L_6.pdf?src-supplier=Avnet+Europe; ComponentLink2Description: http://www.yageo.com/documents/recent/PYu-RC0402_51_RoHS_L_6.pdf?src-supplier=Avnet+Europe; ComponentLink3URL: http://www.farnell.com/datasheets/1018594.pdf?src-supplier=Element14; ComponentLink3Description: http://www.farnell.com/datasheets/1018594.pdf?src-supplier=Element14; ComponentLink4URL: https://www.verical.com/server-webapp/html/getDatasheet?partID=326379&src-supplier=Verical; ComponentLink4Description: https://www.verical.com/server-webapp/html/getDatasheet?partID=326379&src-supplier=Verical; ComponentLink5URL: http://www.farnell.com/datasheets/2167052.pdf?src-supplier=Element14; ComponentLink5Description: http://www.farnell.com/datasheets/2167052.pdf?src-supplier=Element14; Supplier Part Number 1: 311-0.0JRCT-ND; Case/Package: 0402; Mount: Surface Mount
R60 = RES SMD NO BOM 0402: Placeholder for a 0402 resistor
R61 = RES SMD 10K OHM 1% 1/16W 0402: 10 kOhms ±1% 0.063W, 1/16W Chip Resistor 0402 (1005 Metric) Moisture Resistant Thick Film; Manufacturer Part Number: RC0402FR-0710KP; Manufacturer: Yageo; Temperature Coefficient: 150ppm/°C; Max Power Dissipation: 63mW; Supplier 1: Digi-Key; Stock 1: 839368; Pricing 1: 1=0.1, 10=0.035, 100=0.014, 1000=0.0063, 2500=0.0055, 5000=0.0045 (USD); Case Code (Imperial): 0402; Case Code (Metric): 1005; Min Operating Temperature: -55°C; Max Operating Temperature: 155°C; Composition: Thick Film; Packaging: Tape and Reel; Number of Terminations: 2; Length: 0.039inch; Height: 0.016inch; Width: 0.02inch; ComponentLink1URL: http://www.yageo.com/NewPortal/yageodocoutput?fileName=/pdf/R-Chip/PYu-RC_51_RoHS_P_0.pdf&src-supplier=Digi-Key; ComponentLink1Description: http://www.yageo.com/NewPortal/yageodocoutput?fileName=/pdf/R-Chip/PYu-RC_51_RoHS_P_0.pdf&src-supplier=Digi-Key; Supplier Part Number 1: YAG1249CT-ND; Case/Package: 0402; Features: Moisture Resistant; Mount: Surface Mount
R62-R65 = RES SMD 402 OHM 1% 1/16W 0402: 402 Ohms ±1% 0.063W, 1/16W Chip Resistor 0402 (1005 Metric) Moisture Resistant Thick Film; Manufacturer: Yageo; Manufacturer Part Number: RC0402FR-07402RL; Value: 22k; Max Power Dissipation: 63mW; Temperature Coefficient: 100ppm/°C; Power Rating: 62.5mW; Voltage Rating: 50V; Supplier 1: Digi-Key; Stock 1: 0; Pricing 1: 1=0.1, 10=0.016, 100=0.0064, 1000=0.0029, 2500=0.0025, 5000=0.0021 (USD); Case/Package: 0402; Case Code (Metric): 1005; Case Code (Imperial): 0402; Min Operating Temperature: -55°C; Max Operating Temperature: 155°C; Packaging: Tape and Reel; Composition: Thick Film; Number of Terminations: 2; Features: Moisture Resistant; Length: 0.039inch; Height: 0.016inch; Width: 0.02inch; ComponentLink1URL: http://www.yageo.com/documents/recent/PYu-RC0402_51_RoHS_L_6.pdf?src-supplier=Avnet; ComponentLink1Description: http://www.yageo.com/documents/recent/PYu-RC0402_51_RoHS_L_6.pdf?src-supplier=Avnet; ComponentLink2URL: http://www.yageo.com/documents/recent/PYu-RC0402_51_RoHS_L_6.pdf?src-supplier=Avnet+Europe; ComponentLink2Description: http://www.yageo.com/documents/recent/PYu-RC0402_51_RoHS_L_6.pdf?src-supplier=Avnet+Europe; Supplier Part Number 1: YAG3152CT-ND; Contact Plating: Tin,Matte; Termination: SMD/SMT; Military Standard: Not; Depth: 0.5mm; Lead Free: Lead Free; ComponentLink3URL: http://www.mouser.com/ds/2/447/PYu-RC0402_51_RoHS_L_6_r-8721.pdf?src-supplier=Mouser; ComponentLink3Description: http://www.mouser.com/ds/2/447/PYu-RC0402_51_RoHS_L_6_r-8721.pdf?src-supplier=Mouser; Mount: Surface Mount
U6 U7 = FILTER RC(PI) 200 OHM/15PF SMD: EMI filter w/ ESD prot. NUF4401MN 12mm r; Manufacturer: ON Semiconductor; Number of Channels: 4; Frequency: 2.4GHz; Capacitance: 15pF; Number of Elements: 8; Resistance: 200R; Attenuation Value: 35dB; ESD Protection: Yes; Max DC Current: 100nA; DC Resistance (DCR): 230R; Test Frequency: 125MHz; Shielding: Unshielded; Supplier 1: Digi-Key; Manufacturer Part Number: NUF4401MNT1G; Stock 1: 2896; Pricing 1: 1=0.49, 10=0.45, 25=0.4296, 50=0.4158, 100=0.4019, 250=0.3812, 500=0.3188, 1000=0.2474 (USD); Case/Package: DFN; Min Operating Temperature: -40°C; Max Operating Temperature: 85°C; Packaging: Tape and Reel; ComponentLink1URL: http://www.onsemi.com/pub/Collateral/NUF4401MN-D.PDF?src-supplier=Digi-Key; ComponentLink1Description: http://www.onsemi.com/pub/Collateral/NUF4401MN-D.PDF?src-supplier=Digi-Key; ComponentLink2URL: http://www.onsemi.com/pub/Collateral/NUF4401MN-D.PDF?src-supplier=Avnet; ComponentLink2Description: http://www.onsemi.com/pub/Collateral/NUF4401MN-D.PDF?src-supplier=Avnet; ComponentLink3URL: http://www.onsemi.com/pub_link/Collateral/NUF4401MN-D.PDF?src-supplier=Avnet+Europe; ComponentLink3Description: http://www.onsemi.com/pub_link/Collateral/NUF4401MN-D.PDF?src-supplier=Avnet+Europe; ComponentLink4URL: http://www.mouser.com/ds/2/308/NUF4401MN-D-100381.pdf?src-supplier=Mouser; ComponentLink4Description: http://www.mouser.com/ds/2/308/NUF4401MN-D-100381.pdf?src-supplier=Mouser; Supplier Part Number 1: 488-NUF4401MNT1GCT-ND; Number of Pins: 8; Contact Plating: Tin,Matte; Package Quantity: 1; Circuit Type: Filter; Termination: Flat; Number of Lines: 4; Length: 2mm; Height: 1mm; Width: 0.079inch; Depth: 2mm; Radiation Hardening: No; Lead Free: Lead Free; Halogen Free: Halogen Free; Mount: Surface Mount
X2 = CONN HEADER TH R/A 2POS 1.5MM: Connector Header Through Hole, Right Angle 2 position 0.059" (1.50mm); Manufacturer: JST; Manufacturer Part Number: S2B-ZR(LF)(SN); Body Plating: Tin; Number of Positions: 2; Gender: Male; Connector Type: Male Pin; Current Rating: 1A; Contact Resistance: 30mR; Voltage Rating: 50V; Insulation Resistance: 500MR; Pitch: 1.5mm; Panel Thickness: 3.5mm; Supplier 1: Digi-Key; Stock 1: 14685; Pricing 1: 1=0.19, 10=0.177, 100=0.109, 500=0.0902, 1000=0.079, 5000=0.0677, 10000=0.0658 (USD); Mount: Through Hole; Number of Pins: 2; Contact Plating: Tin,Copper; Contact Material: Brass,Tin,Copper; Color: Natural,White; Housing Color: Beige; Housing Material: Polyamide; Material: Nylon; Min Operating Temperature: -25°C; Max Operating Temperature: 85°C; Termination: Press-Fit; Number of Rows: 1; Packaging: Bulk; Fastening Type: Detent; Number of Contacts: 2; Orientation: Right Angle; Voltage Rating (AC): 50V; Voltage Rating (DC): 50V; Max Current Rating: 1A; Max Voltage Rating (AC): 50V; Length: 4.5mm; Height: 7.2mm; Width: 3.5mm; Contact Mating Length: 0.094inch; Depth: 6mm; Lead Pitch: 1.5mm; Lead Free: Lead Free; Flammability Rating: UL94 V-0; REACH SVHC: No SVHC; ComponentLink1URL: http://www.farnell.com/datasheets/80556.pdf?src-supplier=Element14; ComponentLink1Description: http://www.farnell.com/datasheets/80556.pdf?src-supplier=Element14; ComponentLink2URL: http://www1.futureelectronics.com/doc/JST/S2B-ZR(LF)(SN).pdf?src-supplier=Future+Electronics; ComponentLink2Description: http://www1.futureelectronics.com/doc/JST/S2B-ZR(LF)(SN).pdf?src-supplier=Future+Electronics; ComponentLink3URL: http://www.jst-mfg.com/product/pdf/eng/eZH.pdf?src-supplier=Digi-Key; ComponentLink3Description: http://www.jst-mfg.com/product/pdf/eng/eZH.pdf?src-supplier=Digi-Key; ComponentLink4URL: https://www.verical.com/server-webapp/html/getDatasheet?partID=687340&src-supplier=Verical; ComponentLink4Description: https://www.verical.com/server-webapp/html/getDatasheet?partID=687340&src-supplier=Verical; Supplier Part Number 1: 455-1669-ND
X3 = CONN 686108183522 FFC BTM 8POS 1MM SMD R/A: 8 Position FFC Connector Contacts, Bottom 0.039" (1.00mm) Surface Mount, Right Angle; Manufacturer: Wurth Electronics; Pitch: 1mm; Contact Resistance: 30mOhm; Pin Number: 8; Working Voltage: 50VAC; Rated Current: 0.8A; Actuator Material: Nylon,Polyamide; Wire/Cable Type: Straight; Current Rating: 800mA; Mating Cycles: 20; ComponentLink1Description: Manufacturer; ComponentLink1URL: http://www.we-online.de; ComponentLink2Description: Datasheet; ComponentLink2URL: https://katalog.we-online.com/em/datasheet/686108183522.pdf; Packaging: Tape and Reel; Published Date: November 2019; Mounting Technology: SMT; Operating Temperature: -25 to +85degC; Length: 14.2mm; Part Number: 686108183522; Type: Horizontal; Publisher: Wurth Elektronik; Supplier 1: Digi-Key; Manufacturer Part Number: 686108183522; Stock 1: 2013; Pricing 1: 1=1.5, 10=1.35, 100=1.15, 1000=1.05 (USD); Mount: Surface Mount; Contact Material: Bronze; Contact Plating: Tin; Housing Material: Polymer; Housing Color: Beige; Min Operating Temperature: -25°C; Max Operating Temperature: 85°C; Number of Positions: 8; Termination: Solder; Flammability Rating: UL94 V-0; ComponentLink3URL: https://katalog.we-online.de/em/datasheet/686108183522.pdf?src-supplier=Digi-Key; ComponentLink3Description: https://katalog.we-online.de/em/datasheet/686108183522.pdf?src-supplier=Digi-Key; Supplier Part Number 1: 732-11328-1-ND

## Sheet Auxiliary.SchDoc: Auxiliary Components
size A4; DocumentNumber: 22; SheetNumber: 22; SheetTotal: 50
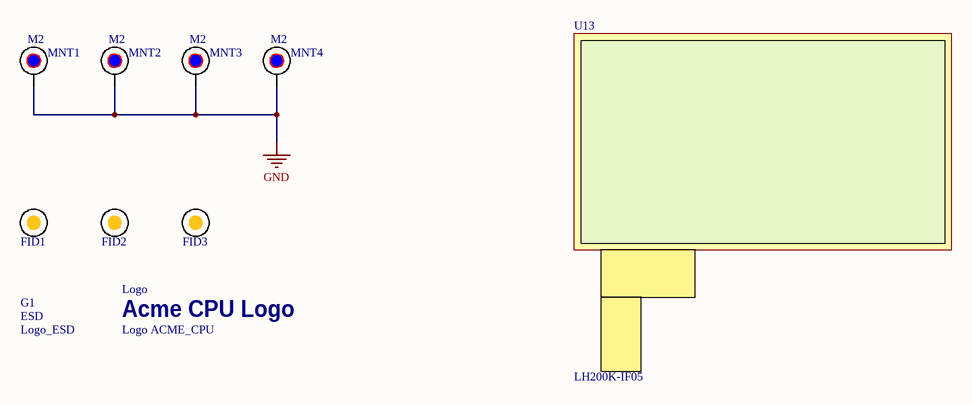
[diagram p11: Auxiliary.SchDoc]

### Parts
FID1  N/A  [Fiducial]  (value not drawn)  (no BOM)
FID2  N/A  [Fiducial]  (value not drawn)  (no BOM)
FID3  N/A  [Fiducial]  (value not drawn)  (no BOM)
G1  Logo_ESD  [Logo_ESD]  (no BOM)
Logo  Logo ACME_CPU  [LOGO_ACME_CPU]  (no BOM)
MNT1  MountHole M2. Nothing to buy or mount  [MountHole_M2]  (value not drawn)  (no BOM)
MNT2  MountHole M2. Nothing to buy or mount  [MountHole_M2]  (value not drawn)  (no BOM)
MNT3  MountHole M2. Nothing to buy or mount  [MountHole_M2]  (value not drawn)  (no BOM)
MNT4  MountHole M2. Nothing to buy or mount  [MountHole_M2]  (value not drawn)  (no BOM)
U13  LH200K-IF05  (mechanical)

### Nets
GND: MNT1.1 MNT2.1 MNT3.1 MNT4.1

### Notes on the sheet
- Title
- Size:
- Date:
- A4
- Number:
- Time:
- Revision:
- Sheet
- of
- File:
- (in symbol Logo ACME_CPU) Acme CPU Logo
- (in symbol Logo_ESD) ESD
- (in symbol MountHole_M2) M2

### Library data of the parts
FID1-FID3 = Fiducial: Fiducial mark.  There is nothing to buy or mount.; ClassName: FiducialMark; CompType: Fiducial; Manufacturer: N/A; MountType: N/A; PackageReference: Fiducial; Manufacturer Part Number: N/A
MNT1-MNT4 = MountHole_M2: PCB Mount Hole. There is nothing to buy or mount.
U13 = MOD LH200K-IF05 240x320 2-inch TFT LCD Display: 2” TFT LCD Display.; Manufacturer: Shenzhen Limito Technology Inc.; Mount: Not Mounted on PCB; Manufacturer Part Number: LH200K-IF05
Logo = Logo ACME_CPU: ClassName: PCB_FEATURE